# EAGLE design proc2 (EAGLE 7.5.0)
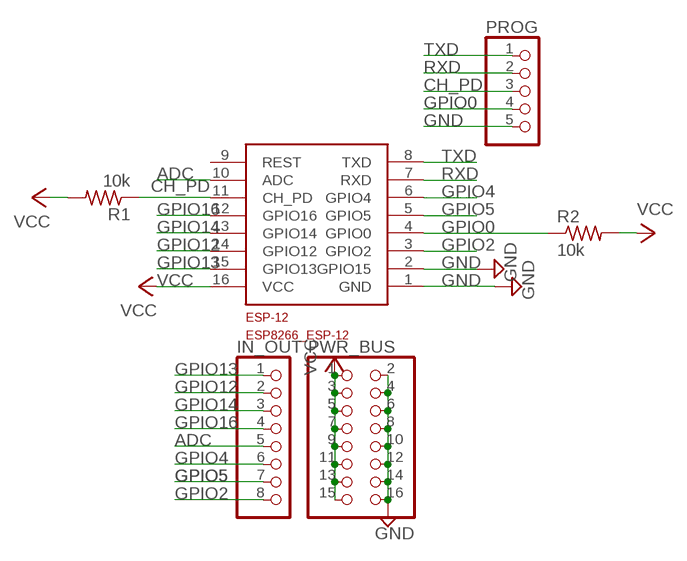
[diagram p0: schematic, sheet 1]

## Parts
ESP-12  ESP8266_ESP-12  [ESP8266-ESP12]
IN_OUT  PINHD-1X8  [1X08]
PROG  PINHD-1X5  [1X05]
PWR_BUS  PINHD-2X8  [2X08]
R1  10k  R-US_M1206  [M1206]
R2  10k  R-US_M1206  [M1206]

## Nets
ADC: ESP-12.10(ADC) IN_OUT.5
CH_PD: ESP-12.11(CH_PD) PROG.3 R1.1
GND: ESP-12.1(GND) ESP-12.2(GPIO15) PROG.5 PWR_BUS.2 PWR_BUS.4 PWR_BUS.6 PWR_BUS.8 PWR_BUS.10 PWR_BUS.12 PWR_BUS.14 PWR_BUS.16
GPIO0: ESP-12.4(GPIO0) PROG.4 R2.1
GPIO2: ESP-12.3(GPIO2) IN_OUT.8
GPIO4: ESP-12.6(GPIO4) IN_OUT.6
GPIO5: ESP-12.5(GPIO5) IN_OUT.7
GPIO12: ESP-12.14(GPIO12) IN_OUT.2
GPIO13: ESP-12.15(GPIO13) IN_OUT.1
GPIO14: ESP-12.13(GPIO14) IN_OUT.3
GPIO16: ESP-12.12(GPIO16) IN_OUT.4
RXD: ESP-12.7(RXD) PROG.2
TXD: ESP-12.8(TXD) PROG.1
VCC: ESP-12.16(VCC) PWR_BUS.1 PWR_BUS.3 PWR_BUS.5 PWR_BUS.7 PWR_BUS.9 PWR_BUS.11 PWR_BUS.13 PWR_BUS.15 R1.2 R2.2
Unconnected: ESP-12.9(REST)

## Library data of the parts
ESP-12 = ESP8266-ESP12:ESP8266_ESP-12
IN_OUT = pinhead:PINHD-1X8: PIN HEADER
PROG = pinhead:PINHD-1X5: PIN HEADER
PWR_BUS = pinhead:PINHD-2X8: PIN HEADER
R1 R2 = rcl:R-US_: RESISTOR, American symbol

## Board
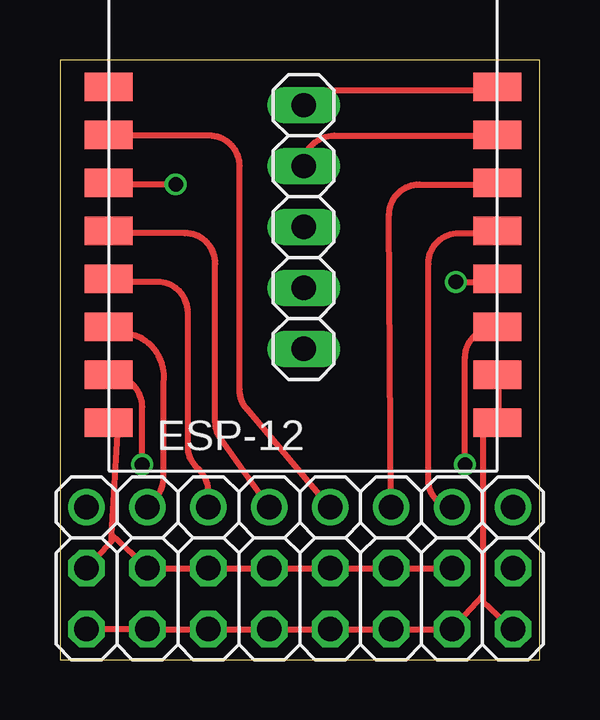
[diagram p1: board, top side]
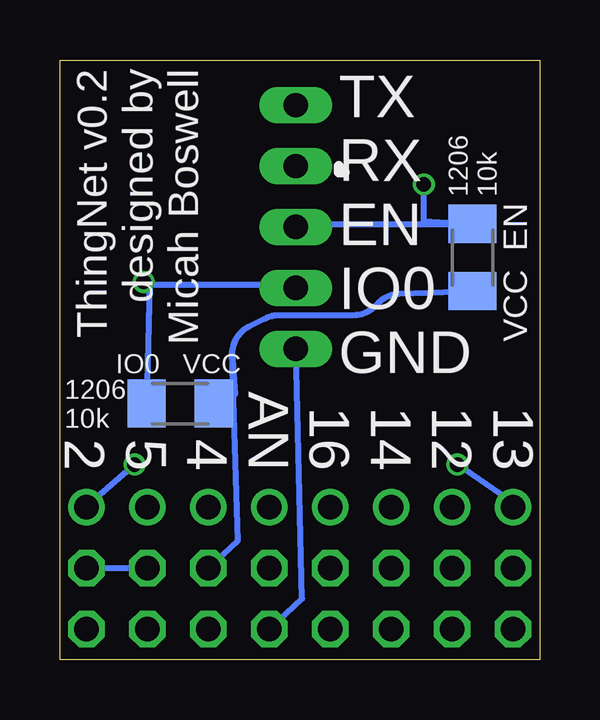
[diagram p2: board, bottom side, seen from below]

Size 20 x 25 mm. Coordinates in mm from the lower left corner, seen from the top.
Outline: 0,0 20,0 20,25 0,25 0,0
Copper layers (1*16): Top 0.035mm / dielectric 1.5mm / Bottom 0.035mm
Design rules "EasyEDA": minimum track width 5mil, minimum drill 12mil, track to track 4mil, track to pad 4mil, pad to pad 4mil, via to via 4mil, smd to smd 0mil, copper to edge 0.3mm, drill to drill 10mil, minimum pad ring 10mil, minimum via ring 6mil, stop-mask expansion 0.1mm, vias tented up to drill 100mil, thermal gap 10mil

### Footprints (pad centres in the part's own frame; a part is rotated, then mirrored left to right if it is on the bottom)
ESP8266-ESP12 = smd 2 x 1.2: 1 16.2,2; 2 16.2,4; 3 16.2,6; 4 16.2,8; 5 16.2,10; 6 16.2,12; 7 16.2,14; 8 16.2,16; 9 0,16; 10 0,14; 11 0,12; 12 0,10; 13 0,8; 14 0,6; 15 0,4; 16 0,2
1X08 = drill 1.016: 1 -8.89,0; 2 -6.35,0; 3 -3.81,0; 4 -1.27,0; 5 1.27,0; 6 3.81,0; 7 6.35,0; 8 8.89,0
1X05 = drill 1.016 long: 1 -5.08,0; 2 -2.54,0; 3 0,0; 4 2.54,0; 5 5.08,0
2X08 = drill 1.016 octagon: 1 -8.89,-1.27; 2 -8.89,1.27; 3 -6.35,-1.27; 4 -6.35,1.27; 5 -3.81,-1.27; 6 -3.81,1.27; 7 -1.27,-1.27; 8 -1.27,1.27; 9 1.27,-1.27; 10 1.27,1.27; 11 3.81,-1.27; 12 3.81,1.27; 13 6.35,-1.27; 14 6.35,1.27; 15 8.89,-1.27; 16 8.89,1.27
M1206 = smd 1.6 x 2: 1 -1.4,0; 2 1.4,0

### Placement (x,y rotation side)
ESP-12  2.03,7.87 0 top
IN_OUT  10,6.35 0 top
PROG  10.16,18.03 270 top
PWR_BUS  10,2.54 180 top
R1  2.79,16.76 270 bottom
R2  14.99,10.67 0 bottom

### Tracks (layer width: path | path; a pad name or v marks a point on that pad's centre or on a via)
ADC
  Top 0.254: IN_OUT.5 7.79,10.44 arc-40 7.49,11.26 7.49,20.57 arc90 6.22,21.84 2.03,21.84 ESP-12.10
CH_PD  (via drill 0.61)
  Top 0.254: v4.83,19.81 2.03,19.81 ESP-12.11
  Bottom 0.254: PROG.3 10.03,18.16 6.35,18.16 R1.1 4.83,18.29 v4.83,19.81
GND
  Top 0.254: ESP-12.2 18.29,11.81 18.29,9.91 ESP-12.1 18.16,9.78 17.65,9.53 17.65,2.67 | 17.65,2.67 17.65,2.41 PWR_BUS.2 | 17.65,2.67 PWR_BUS.4 PWR_BUS.6 PWR_BUS.8 PWR_BUS.10 PWR_BUS.12 PWR_BUS.14 PWR_BUS.16
  Bottom 0.254: PROG.5 9.91,2.54 PWR_BUS.8
GPIO0  (via drill 0.61)
  Top 0.254: v16.51,15.75 18.16,15.75 ESP-12.4
  Bottom 0.254: PROG.4 10.29,15.62 16.26,15.62 R2.1 16.26,15.75 v16.51,15.75
GPIO2  (via drill 0.61)
  Top 0.254: v16.89,8.13 16.89,12.57 arc-90 18.16,13.84 ESP-12.3
  Bottom 0.254: v16.89,8.13 18.8,6.48 IN_OUT.8
GPIO4
  Top 0.254: IN_OUT.6 13.72,18.53 arc-90 14.99,19.81 18.16,19.81 ESP-12.6
GPIO5
  Top 0.254: IN_OUT.7 arc-83 15.37,7.47 15.37,16.51 arc-90 16.64,17.78 18.16,17.78 ESP-12.5
GPIO12
  Top 0.254: IN_OUT.2 4,6.75 arc41 4.32,7.59 4.32,11.56 arc90 2.79,13.59 2.03,13.84 ESP-12.14
GPIO13  (via drill 0.61)
  Top 0.254: v3.43,8.13 3.43,10.54 arc90 2.16,11.81 2.03,11.81 ESP-12.15
  Bottom 0.254: v3.43,8.13 1.02,6.48 IN_OUT.1
GPIO14
  Top 0.254: IN_OUT.3 6.19,7 arc45 5.82,7.9 5.71,8.01 arc-45 5.33,8.91 5.33,14.48 arc90 4.06,15.75 2.03,15.75 ESP-12.13
GPIO16
  Top 0.254: IN_OUT.4 6.71,9.2 arc-35 6.48,9.93 6.48,16.51 arc90 5.21,17.78 2.03,17.78 ESP-12.12
RXD
  Top 0.254: PROG.2 arc-90 11.43,21.84 18.16,21.84 ESP-12.7
TXD
  Top 0.254: PROG.1 arc-90 10.79,23.75 18.16,23.75 ESP-12.8
VCC
  Top 0.254: 2.16,5.21 2.16,4.95 PWR_BUS.15 | 2.16,5.21 2.41,9.4 2.03,9.78 ESP-12.16 | 2.16,5.21 PWR_BUS.13 PWR_BUS.11 PWR_BUS.9 PWR_BUS.7 PWR_BUS.5 PWR_BUS.3
  Bottom 0.254: R1.2 5.85,15.26 arc-43 6.7,14.89 6.87,14.72 arc45 7.76,14.35 10.88,14.35 arc-27 11.44,14.22 12.12,13.88 arc-54 12.81,12.95 12.83,12.83 | 12.83,12.83 12.7,11.05 R2.2 | PWR_BUS.3 PWR_BUS.1 | 12.83,12.83 12.57,4.95 PWR_BUS.5

### Text on the board
bNames: ThingNet v0.2 / designed by / Micah Boswell | EN | 1206 / 10k | VCC | TX / RX / EN / IO0 / GND | IO0 VCC | 1206 / 10k | 13 / 12 / 14 / 16 / AN / 4 / 5 / 2